# Altium schematic sheet Sheet1.SchDoc
size A4; SheetNumber: 1; SheetTotal: 1
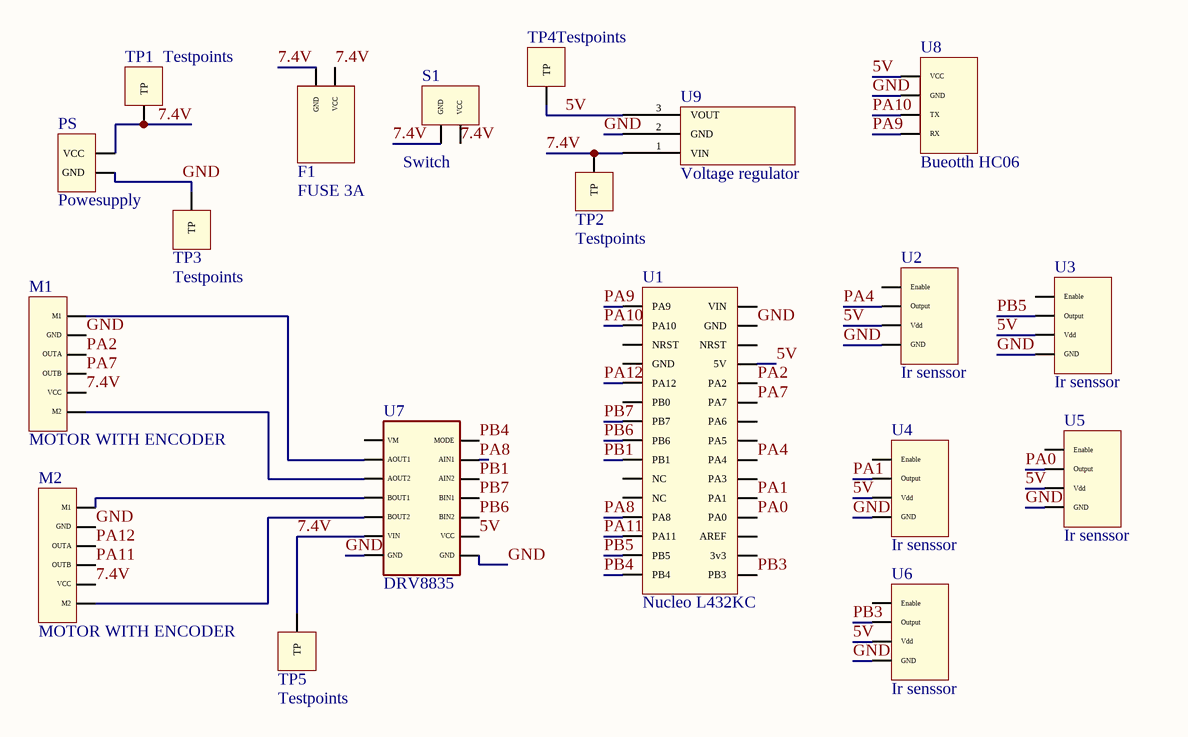
[diagram p0: Sheet1.SchDoc]

## Parts
F1  FUSE 3A  [Fuse]
M1  MOTOR WITH ENCODER  [OUTPUTa]
M2  MOTOR WITH ENCODER  [OUTPUTB]
PS  Powesupply  [Power Suply]
S1  Switch  [Switch]
TP1  Testpoints  [TP]
TP2  Testpoints  [TP]
TP3  Testpoints  [TP]
TP4  Testpoints  [TP]
TP5  Testpoints  [TP]
U1  Nucleo L432KC  [Nucleo L432kc]
U2  Ir senssor  [IR sensor]
U3  Ir senssor  [IR sensor]
U4  Ir senssor  [IR sensor]
U5  Ir senssor  [IR sensor]
U6  Ir senssor  [IR sensor]
U7  DRV8835  [Motor Driver]
U8  Bueotth HC06  [Bluetooth]
U9  Voltage regulator  [Voltage Regulator]

## Nets
5V: TP4.1(TP) U1.19(5V) U2.3(Vdd) U3.3(Vdd) U4.3(Vdd) U5.3(Vdd) U6.3(Vdd) U7.13(VCC) U8.1(VCC) U9.3(VOUT)
7.4V: F1.1(VCC) F1.2(GND) M1.5(VCC) M2.5(VCC) PS.1(VCC) S1.1(VCC) S1.2(GND) TP1.1(TP) TP2.1(TP) TP5.1(TP) U7.6(VIN) U9.1(VIN)
GND: M1.2(GND) M2.2(GND) PS.2(GND) TP3.1(TP) U1.17(GND) U2.4(GND) U3.4(GND) U4.4(GND) U5.4(GND) U6.4(GND) U7.7(GND) U7.11(GND) U8.2(GND) U9.2(GND)
PA0: U1.27(PA0) U5.2(Output)
PA1: U1.26(PA1) U4.2(Output)
PA2: M1.3(OUTA) U1.20(PA2)
PA4: U1.24(PA4) U2.2(Output)
PA7: M1.4(OUTB) U1.21(PA7)
PA8: U1.12(PA8) U7.9(AIN1)
PA9: U1.1(PA9) U8.4(RX)
PA10: U1.2(PA10) U8.3(TX)
PA11: M2.4(OUTB) U1.13(PA11)
PA12: M2.3(OUTA) U1.5(PA12)
PB1: U1.9(PB1) U7.10(AIN2)
PB3: U1.30(PB3) U6.2(Output)
PB4: U1.15(PB4) U7.8(MODE)
PB5: U1.14(PB5) U3.2(Output)
PB6: U1.8(PB6) U7.12(BIN2)
PB7: U1.7(PB7) U7.11(BIN1)
NetM1_1: M1.1(M1) U7.2(AOUT1)
NetM1_6: M1.6(M2) U7.3(AOUT2)
NetM2_1: M2.1(M1) U7.4(BOUT1)
NetM2_6: M2.6(M2) U7.5(BOUT2)

Not connected (* = marked no-connect by the designer): U1 3(NRST) 4(GND) 6(PB0) 10(NC) 11(NC) 16(VIN) 18(NRST) 22(PA6) 23(PA5) 25(PA3) 28(AREF) 29(3v3); U2 1(Enable); U3 1(Enable); U4 1(Enable); U5 1(Enable); U6 1(Enable); U7 1(VM)

## Library data of the parts
F1 = Fuse
M1 = OutputA
M2 = OutputB
U2-U6 = Ir proximity sensor
U7 = Motor driver
U8 = Bueotth HC06: 3.7 cm x 1.5 cm